# Altium schematic sheet kamal_schematic.SchDoc
size A1; SheetNumber: 1; SheetTotal: 1
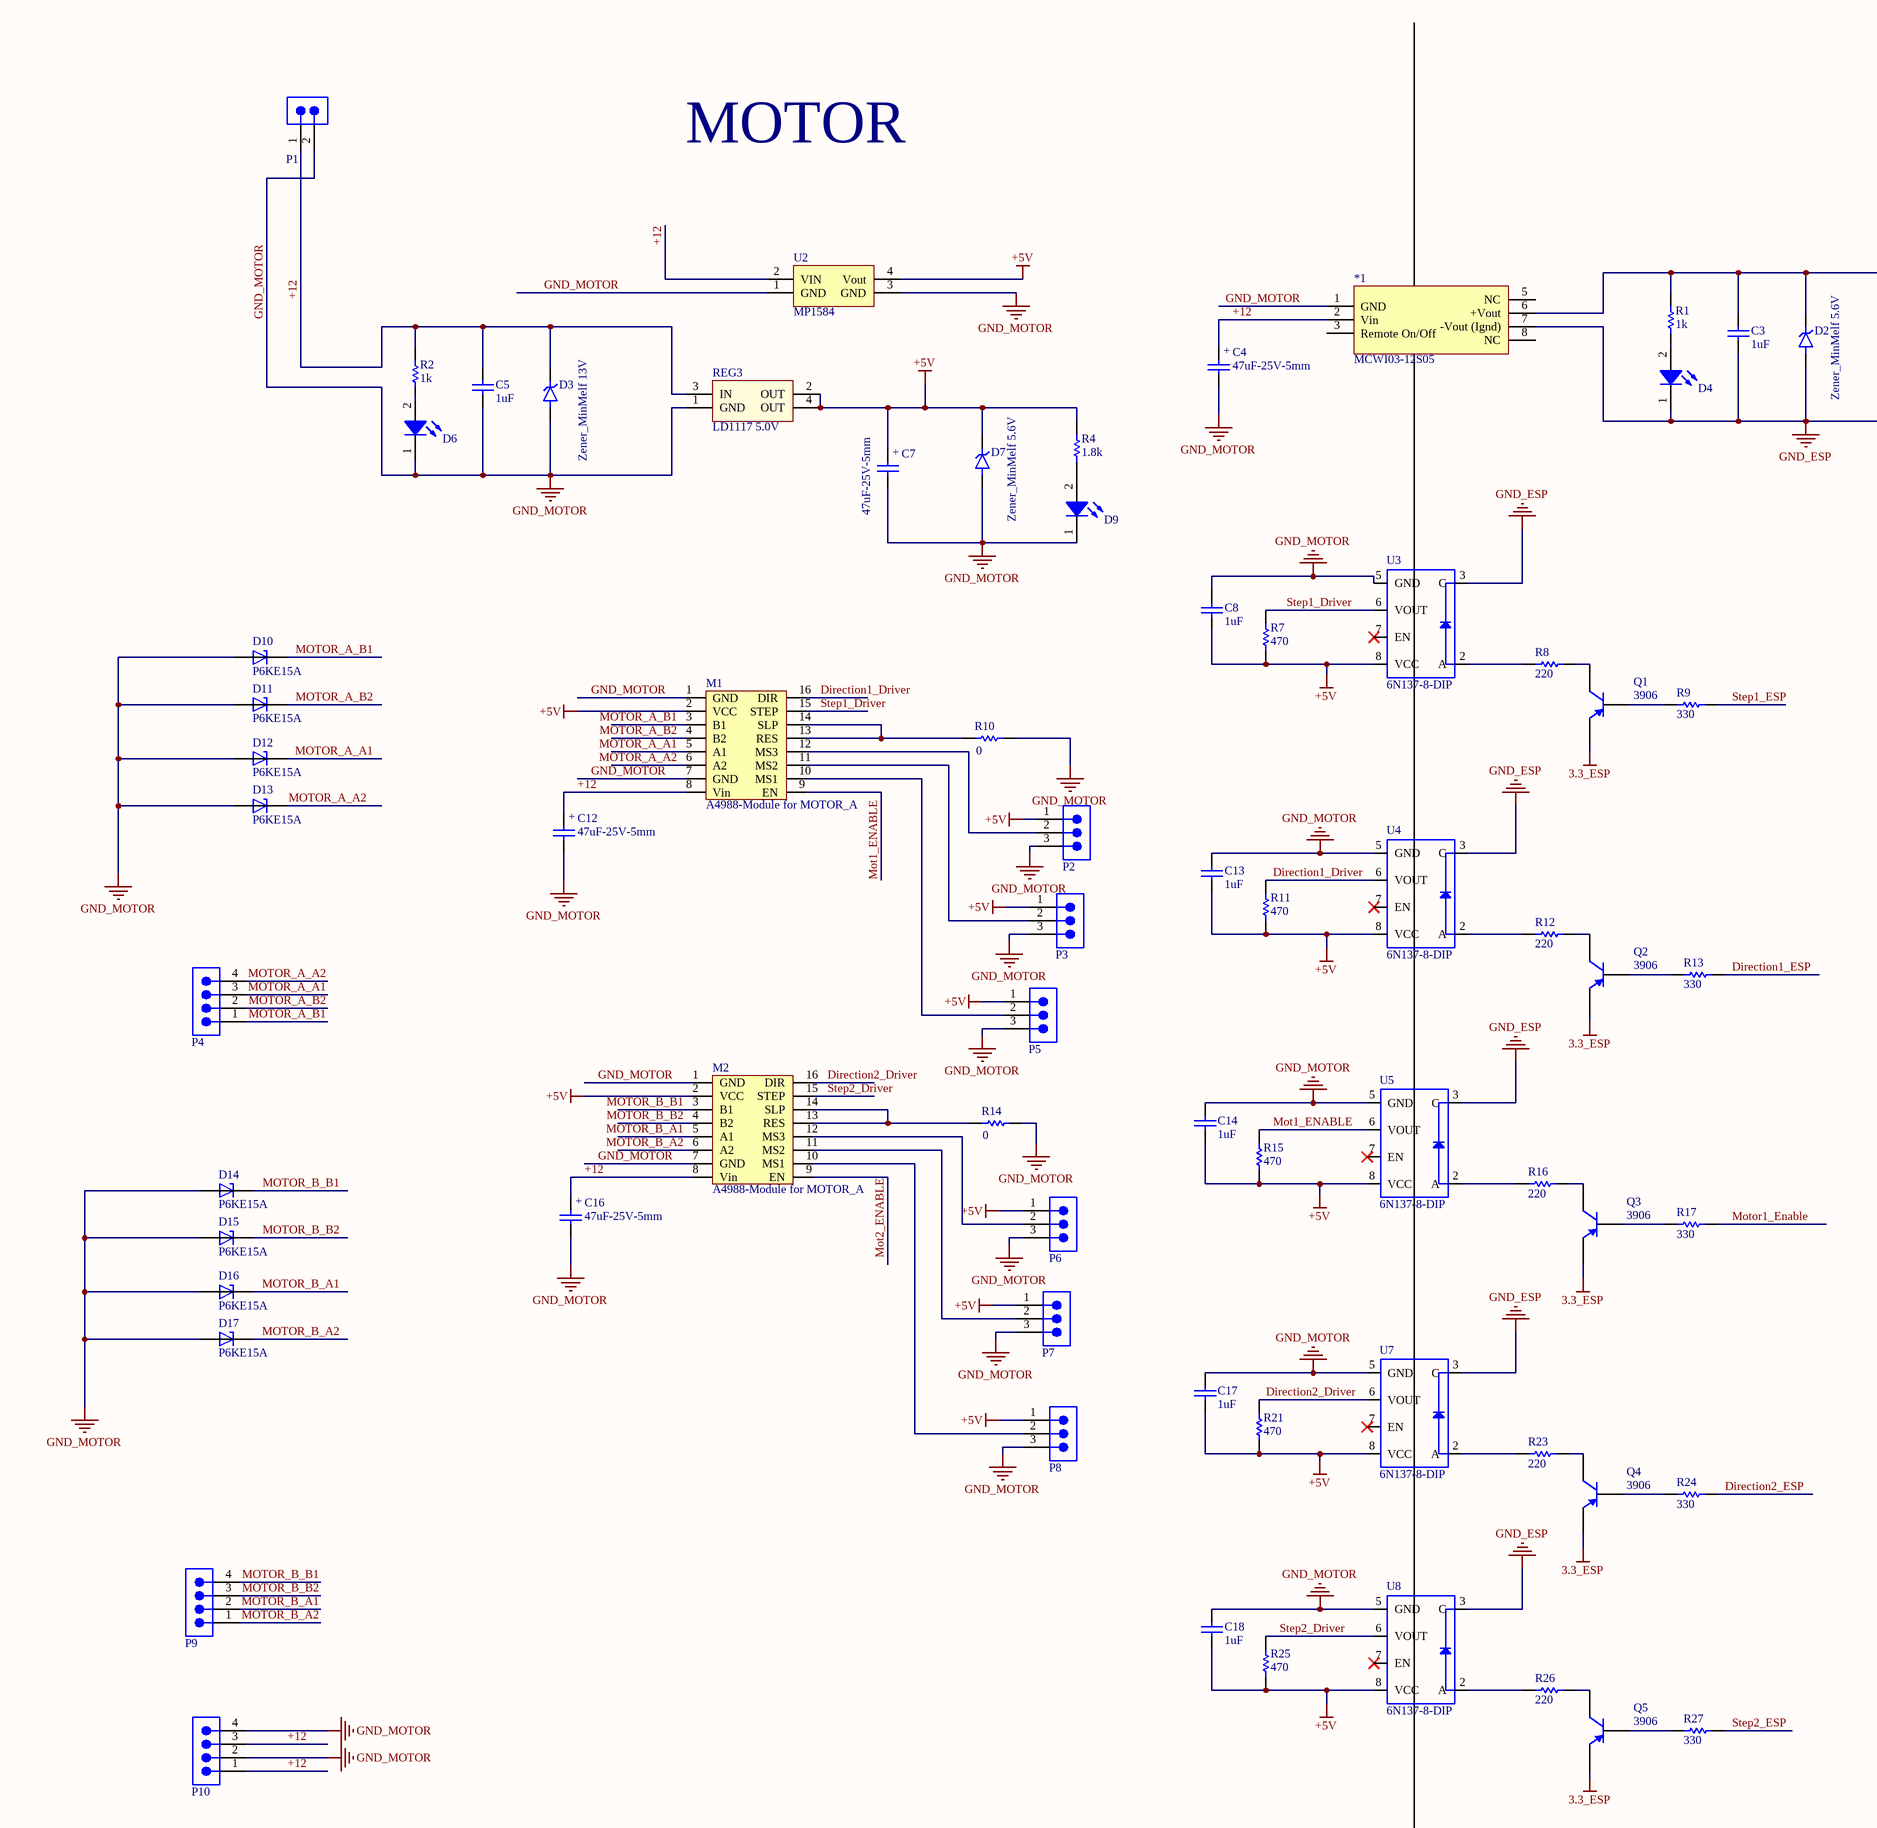
[diagram p0: kamal_schematic.SchDoc, top left]
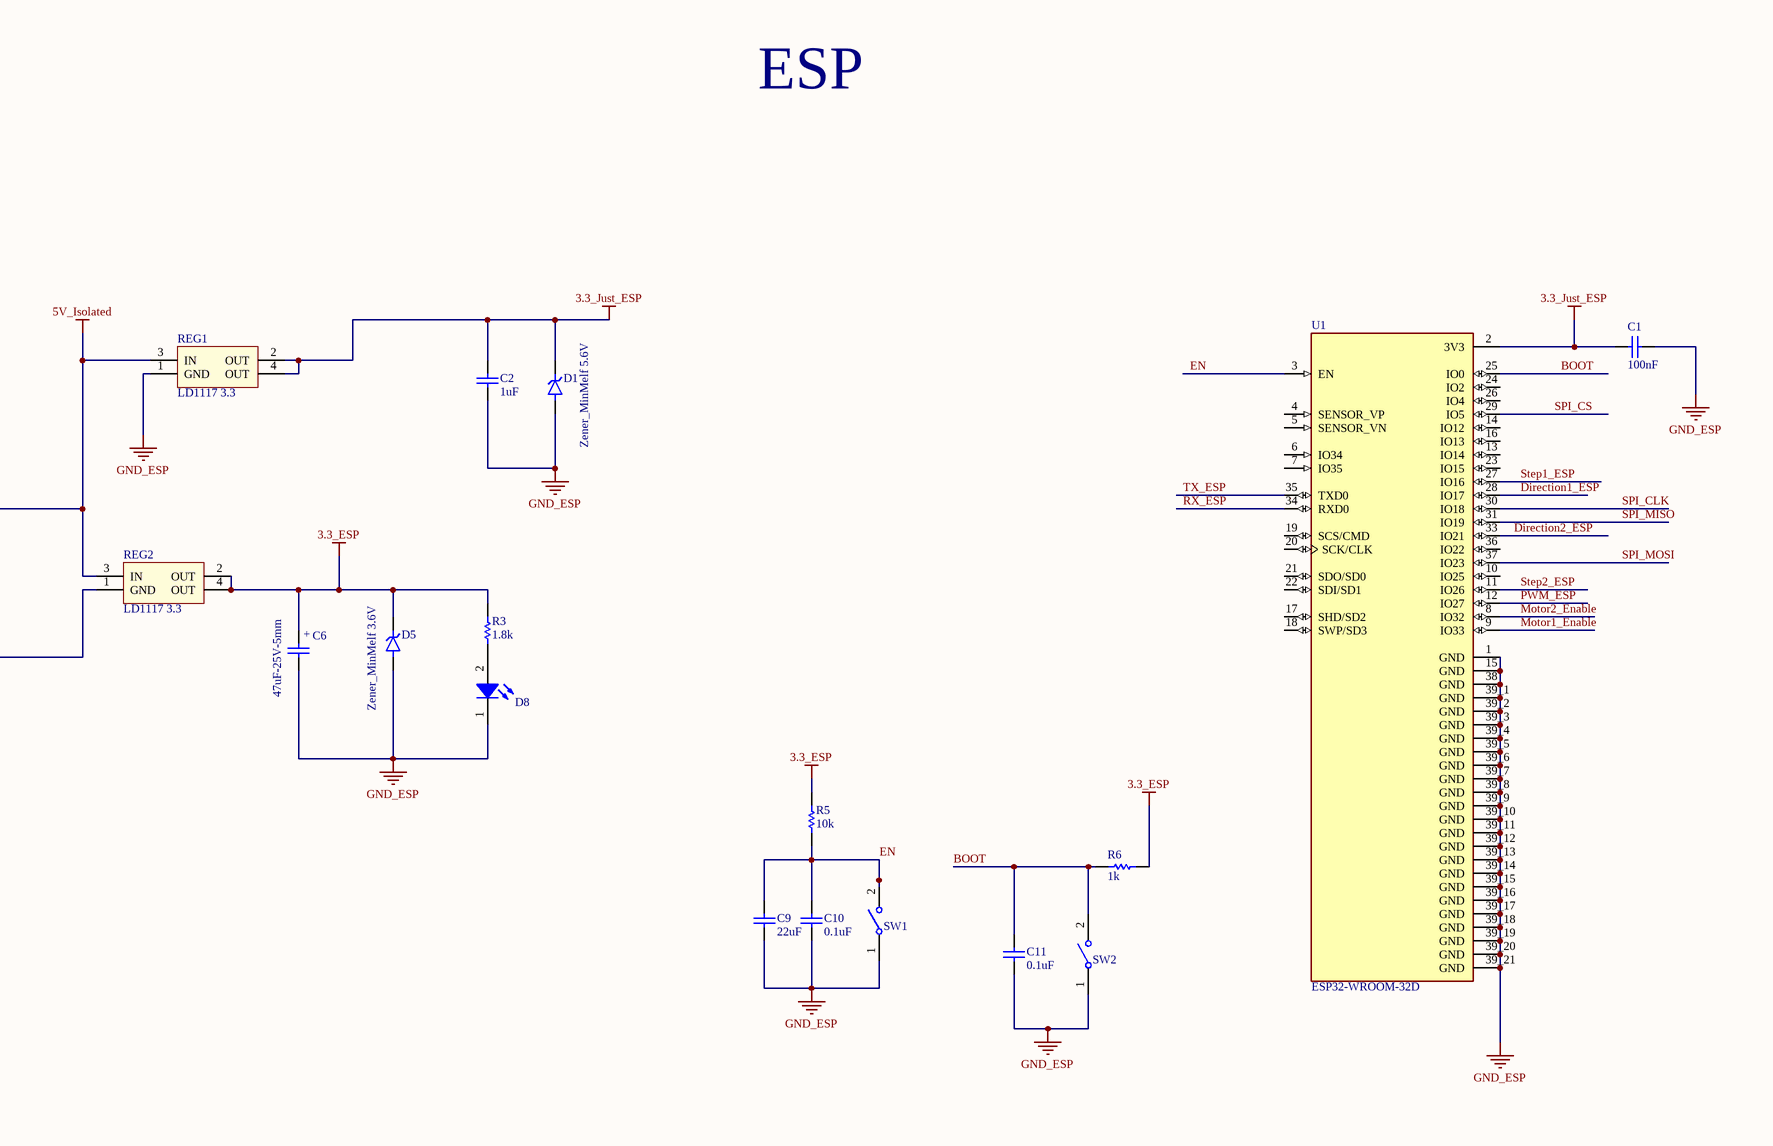
[diagram p1: kamal_schematic.SchDoc, top right]
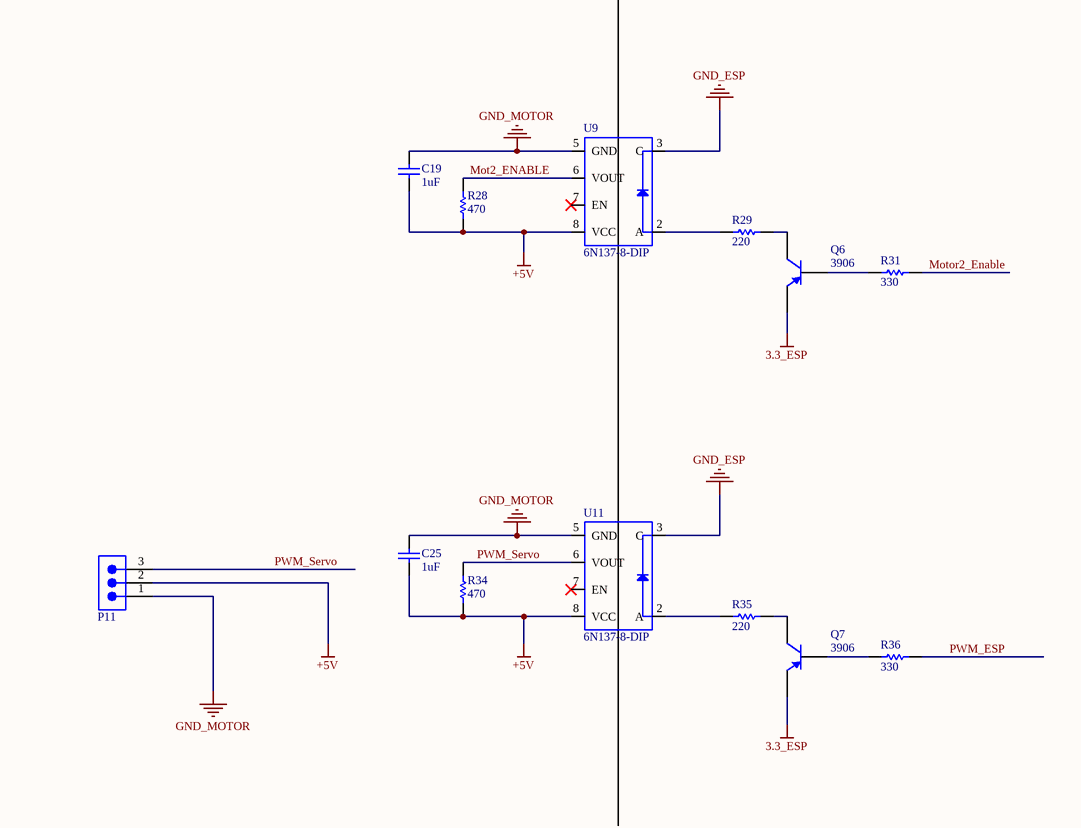
[diagram p2: kamal_schematic.SchDoc, bottom left]
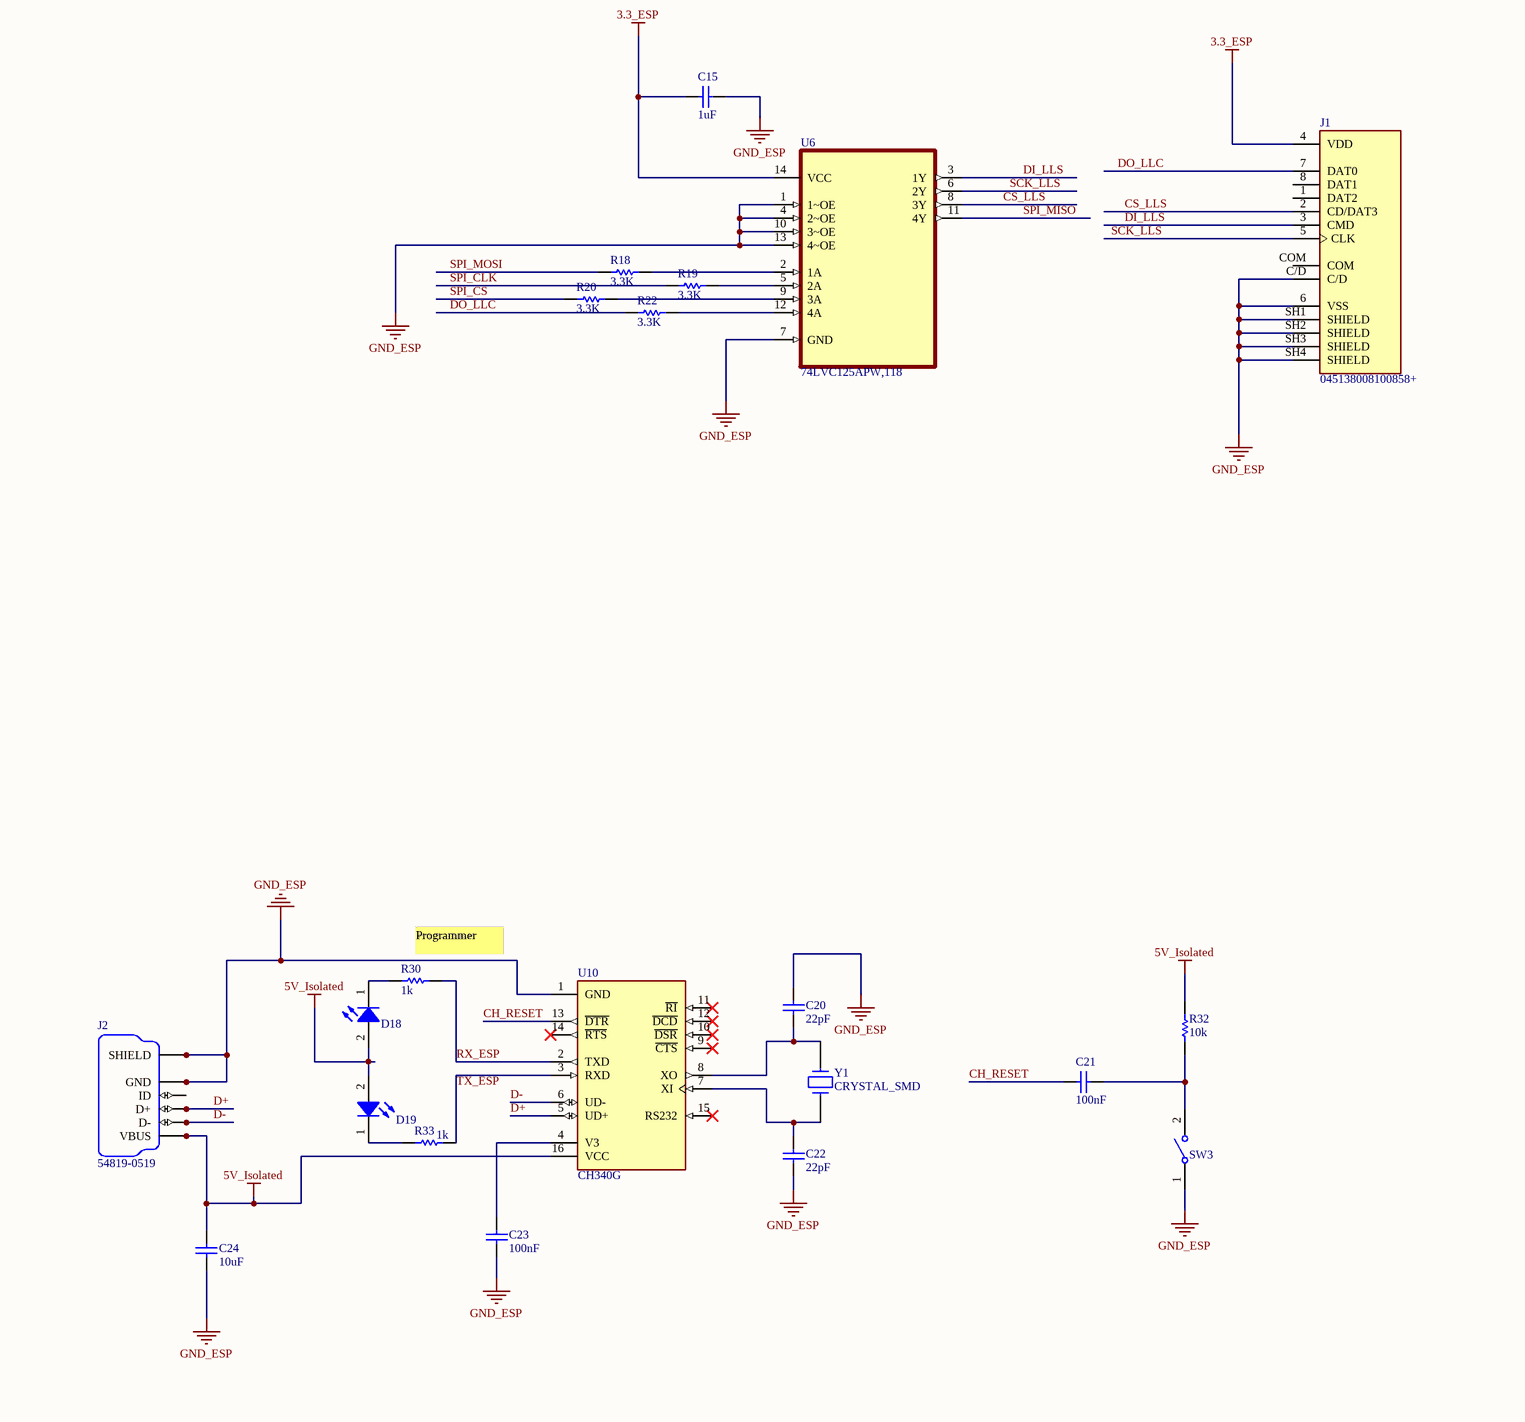
[diagram p3: kamal_schematic.SchDoc, bottom right]

## Parts
*1  MCWI03-12S05  [MCWI03-12S05]
C1  100nF  [SMD 805 CAP]
C2  1uF  [SMD 805 CAP]
C3  1uF  [SMD 805 CAP]
C4  47uF-25V-5mm  [MY_CAP_POL 5MM]
C5  1uF  [SMD 805 CAP]
C6  47uF-25V-5mm  [MY_CAP_POL 5MM]
C7  47uF-25V-5mm  [MY_CAP_POL 5MM]
C8  1uF  [SMD 805 CAP]
C9  22uF  [SMD 805 CAP]
C10  0.1uF  [SMD 805 CAP]
C11  0.1uF  [SMD 805 CAP]
C12  47uF-25V-5mm  [MY_CAP_POL 5MM]
C13  1uF  [SMD 805 CAP]
C14  1uF  [SMD 805 CAP]
C15  1uF  [SMD 805 CAP]
C16  47uF-25V-5mm  [MY_CAP_POL 5MM]
C17  1uF  [SMD 805 CAP]
C18  1uF  [SMD 805 CAP]
C19  1uF  [SMD 805 CAP]
C20  22pF  [C_805]
C21  100nF  [C_805]
C22  22pF  [C_805]
C23  100nF  [C_805]
C24  10uF  [Tantalum_B]
C25  1uF  [SMD 805 CAP]
D1  Zener_MinMelf 5.6V  [MiniMelf]
D2  Zener_MinMelf 5.6V  [MiniMelf]
D3  Zener_MinMelf 13V  [MiniMelf]
D4  LED_SMD_0805  [LED_0805]  (value not drawn)
D5  Zener_MinMelf 3.6V  [MiniMelf]
D6  LED_SMD_0805  [LED_0805]  (value not drawn)
D7  Zener_MinMelf 5.6V  [MiniMelf]
D8  LED_SMD_0805  [LED_0805]  (value not drawn)
D9  LED_SMD_0805  [LED_0805]  (value not drawn)
D10  P6KE15A  [P6KE15A]
D11  P6KE15A  [P6KE15A]
D12  P6KE15A  [P6KE15A]
D13  P6KE15A  [P6KE15A]
D14  P6KE15A  [P6KE15A]
D15  P6KE15A  [P6KE15A]
D16  P6KE15A  [P6KE15A]
D17  P6KE15A  [P6KE15A]
D18  LED_SMD_0805  [LED_0805]  (value not drawn)
D19  LED_SMD_0805  [LED_0805]  (value not drawn)
J1  045138008100858+  [AVX_045138008100858+]
J2  54819-0519  [MOLEX_54819-0519]
M1  A4988-Module for MOTOR_A  [A4988-Module - duplicate]
M2  A4988-Module for MOTOR_A  [A4988-Module - duplicate]
P1  691321300002  [691321300002]  (value not drawn)
P2  61300311121  [61300311121]  (value not drawn)
P3  61300311121  [61300311121]  (value not drawn)
P4  691321300004  [691321300004]  (value not drawn)
P5  61300311121  [61300311121]  (value not drawn)
P6  61300311121  [61300311121]  (value not drawn)
P7  61300311121  [61300311121]  (value not drawn)
P8  61300311121  [61300311121]  (value not drawn)
P9  691321300004  [691321300004]  (value not drawn)
P10  691321300004  [691321300004]  (value not drawn)
P11  691321300003  [691321300003]  (value not drawn)
Q1  3906  [MY_SMD_TRANSISTOR]
Q2  3906  [MY_SMD_TRANSISTOR]
Q3  3906  [MY_SMD_TRANSISTOR]
Q4  3906  [MY_SMD_TRANSISTOR]
Q5  3906  [MY_SMD_TRANSISTOR]
Q6  3906  [MY_SMD_TRANSISTOR]
Q7  3906  [MY_SMD_TRANSISTOR]
R1  1k  [SMD 805]
R2  1k  [SMD 805]
R3  1.8k  [SMD 805]
R4  1.8k  [SMD 805]
R5  10k  [SMD 805]
R6  1k  [SMD 805]
R7  470  [SMD 805]
R8  220  [SMD 805]
R9  330  [SMD 805]
R10  0  [SMD 805]
R11  470  [SMD 805]
R12  220  [SMD 805]
R13  330  [SMD 805]
R14  0  [SMD 805]
R15  470  [SMD 805]
R16  220  [SMD 805]
R17  330  [SMD 805]
R18  3.3K  [SMD 805]
R19  3.3K  [SMD 805]
R20  3.3K  [SMD 805]
R21  470  [SMD 805]
R22  3.3K  [SMD 805]
R23  220  [SMD 805]
R24  330  [SMD 805]
R25  470  [SMD 805]
R26  220  [SMD 805]
R27  330  [SMD 805]
R28  470  [SMD 805]
R29  220  [SMD 805]
R30  value 1k  [R_805]  (hidden comment: Resistor SMD 0603)
R31  330  [SMD 805]
R32  value 10k  [R_805]  (hidden comment: Resistor SMD 0603)
R33  value 1k  [R_805]  (hidden comment: Resistor SMD 0603)
R34  470  [SMD 805]
R35  220  [SMD 805]
R36  330  [SMD 805]
REG1  LD1117 3.3  [MY_LD1117-3.3]
REG2  LD1117 3.3  [MY_LD1117-3.3]
REG3  LD1117 5.0V  [MY_LD1117-3.3]
SW1  434121043836  [WS-TASV_L6W3.5H4.3_4341x10438x6]  (value not drawn)
SW2  434121043836  [WS-TASV_L6W3.5H4.3_4341x10438x6]  (value not drawn)
SW3  434121043836  [WS-TASV_L6W3.5H4.3_4341x10438x6]  (value not drawn)
U1  ESP32-WROOM-32D  [MODULE_ESP32-WROOM-32D]
U2  MP1584  [MP1584]
U3  6N137-8-DIP  [PDIP-8]
U4  6N137-8-DIP  [PDIP-8]
U5  6N137-8-DIP  [PDIP-8]
U6  74LVC125APW,118  [SOP65P640X110-14N]
U7  6N137-8-DIP  [PDIP-8]
U8  6N137-8-DIP  [PDIP-8]
U9  6N137-8-DIP  [PDIP-8]
U10  CH340G  [SOIC127P600X180-16N]
U11  6N137-8-DIP  [PDIP-8]
Y1  CRYSTAL_SMD  [My_Crystal - SMD]

## Nets
3.3_ESP: C6.+ C15.1 D5.2 J1.4(VDD) Q1.E Q2.E Q3.E Q4.E Q5.E Q6.E Q7.E R3.2 R5.2 R6.2 REG2.2(OUT) REG2.4(OUT) U6.14(VCC)
3.3_Just_ESP: C1.2 C2.2 D1.2 REG1.2(OUT) REG1.4(OUT) U1.2(3V3)
5V_Isolated: *1.6(+Vout) C3.2 C24.2 D2.2 D18.2(A) D19.2(A) J2.1(VBUS) J2.6(VBUS) R1.2 R32.1 REG1.3(IN) REG2.3(IN) U10.16(VCC)
+5V: C7.+ C8.2 C13.2 C14.2 C17.2 C18.2 C19.2 C25.2 D7.2 M1.2(VCC) M2.2(VCC) P2.1 P3.1 P5.1 P6.1 P7.1 P8.1 P11.2 R4.2 R7.2 R11.2 R15.2 R21.2 R25.2 R28.2 R34.2 REG3.2(OUT) REG3.4(OUT) U2.4(Vout) U3.8(VCC) U4.8(VCC) U5.8(VCC) U7.8(VCC) U8.8(VCC) U9.8(VCC) U11.8(VCC)
GND_ESP: *1.7(-Vout_(Ignd)) C1.1 C2.1 C3.1 C6.- C9.1 C10.1 C11.1 C15.2 C20.1 C22.2 C23.2 C24.1 D1.1 D2.1 D4.1(K) D5.1 D8.1(K) J1.6(VSS) J1.C/D J1.SH1(SHIELD) J1.SH2(SHIELD) J1.SH3(SHIELD) J1.SH4(SHIELD) J2.5(GND) J2.10(GND) J2.11(SHIELD) J2.12(SHIELD) J2.S1(SHIELD) J2.S2(SHIELD) REG1.1(GND) REG2.1(GND) SW1.1 SW2.1 SW3.1 U1.1(GND) U1.15(GND) U1.38(GND) U1.39_1(GND) U1.39_2(GND) U1.39_3(GND) U1.39_4(GND) U1.39_5(GND) U1.39_6(GND) U1.39_7(GND) U1.39_8(GND) U1.39_9(GND) U1.39_10(GND) U1.39_11(GND) U1.39_12(GND) U1.39_13(GND) U1.39_14(GND) U1.39_15(GND) U1.39_16(GND) U1.39_17(GND) U1.39_18(GND) U1.39_19(GND) U1.39_20(GND) U1.39_21(GND) U3.3(C) U4.3(C) U5.3(C) U6.1(1~OE) U6.4(2~OE) U6.7(GND) U6.10(3~OE) U6.13(4~OE) U7.3(C) U8.3(C) U9.3(C) U10.1(GND) U11.3(C)
GND_MOTOR: *1.1(GND) C4.- C5.1 C7.- C8.1 C12.- C13.1 C14.1 C16.- C17.1 C18.1 C19.1 C25.1 D3.1 D6.1(K) D7.1 D9.1(K) D10.A D11.A D12.A D13.A D14.A D15.A D16.A D17.A M1.1(GND) M1.7(GND) M2.1(GND) M2.7(GND) P1.2 P2.3 P3.3 P5.3 P6.3 P7.3 P8.3 P10.2 P10.4 P11.1 R10.1 R14.1 REG3.1(GND) U2.1(GND) U2.3(GND) U3.5(GND) U4.5(GND) U5.5(GND) U7.5(GND) U8.5(GND) U9.5(GND) U11.5(GND)
+12: *1.2(Vin) C4.+ C5.2 C12.+ C16.+ D3.2 M1.8(Vin) M2.8(Vin) P1.1 P10.1 P10.3 R2.2 REG3.3(IN) U2.2(VIN)
BOOT: C11.2 R6.1 SW2.2 U1.25(IO0)
CH_RESET: C21.2 U10.13(~{DTR})
CS_LLS: J1.2(CD/DAT3) U6.8(3Y)
D+: J2.3(D+) J2.8(D+) U10.5(UD+)
D-: J2.2(D-) J2.7(D-) U10.6(UD-)
DI_LLS: J1.3(CMD) U6.3(1Y)
Direction1_Driver: M1.16(DIR) R11.1 U4.6(VOUT)
Direction1_ESP: R13.2 U1.28(IO17)
Direction2_Driver: M2.16(DIR) R21.1 U7.6(VOUT)
Direction2_ESP: R24.2 U1.33(IO21)
DO_LLC: J1.7(DAT0) R22.1
EN: C9.2 C10.2 R5.1 SW1.2 U1.3(EN)
Mot1_ENABLE: M1.9(EN) R15.1 U5.6(VOUT)
Mot2_ENABLE: M2.9(EN) R28.1 U9.6(VOUT)
Motor1_Enable: R17.2 U1.9(IO33)
Motor2_Enable: R31.2 U1.8(IO32)
MOTOR_A_A1: D12.C M1.5(A1) P4.3
MOTOR_A_A2: D13.C M1.6(A2) P4.4
MOTOR_A_B1: D10.C M1.3(B1) P4.1
MOTOR_A_B2: D11.C M1.4(B2) P4.2
MOTOR_B_A1: D16.C M2.5(A1) P9.2
MOTOR_B_A2: D17.C M2.6(A2) P9.1
MOTOR_B_B1: D14.C M2.3(B1) P9.4
MOTOR_B_B2: D15.C M2.4(B2) P9.3
PWM_ESP: R36.2 U1.12(IO27)
PWM_Servo: P11.3 R34.1 U11.6(VOUT)
RX_ESP: R30.2 U1.34(RXD0) U10.2(TXD)
SCK_LLS: J1.5(CLK) U6.6(2Y)
SPI_CLK: R19.1 U1.30(IO18)
SPI_CS: R20.1 U1.29(IO5)
SPI_MISO: U1.31(IO19) U6.11(4Y)
SPI_MOSI: R18.1 U1.37(IO23)
Step1_Driver: M1.15(STEP) R7.1 U3.6(VOUT)
Step1_ESP: R9.2 U1.27(IO16)
Step2_Driver: M2.15(STEP) R25.1 U8.6(VOUT)
Step2_ESP: R27.2 U1.11(IO26)
TX_ESP: R33.2 U1.35(TXD0) U10.3(RXD)
NetC20_2: C20.2 U10.8(XO) Y1.2
NetC21_1: C21.1 R32.2 SW3.2
NetC22_1: C22.1 U10.7(XI) Y1.1
NetC23_1: C23.1 U10.4(V3)
NetD4_2: D4.2(A) R1.1
NetD6_2: D6.2(A) R2.1
NetD8_2: D8.2(A) R3.1
NetD9_2: D9.2(A) R4.1
NetD18_1: D18.1(K) R30.1
NetD19_1: D19.1(K) R33.1
NetJ2_4: J2.4(ID) J2.9(ID)
NetM1_10: M1.10(MS1) P5.2
NetM1_11: M1.11(MS2) P3.2
NetM1_12: M1.12(MS3) P2.2
NetM1_13: M1.13(RES) M1.14(SLP) R10.2
NetM2_10: M2.10(MS1) P8.2
NetM2_11: M2.11(MS2) P7.2
NetM2_12: M2.12(MS3) P6.2
NetM2_13: M2.13(RES) M2.14(SLP) R14.2
NetQ1_B: Q1.B R9.1
NetQ1_C: Q1.C R8.2
NetQ2_B: Q2.B R13.1
NetQ2_C: Q2.C R12.2
NetQ3_B: Q3.B R17.1
NetQ3_C: Q3.C R16.2
NetQ4_B: Q4.B R24.1
NetQ4_C: Q4.C R23.2
NetQ5_B: Q5.B R27.1
NetQ5_C: Q5.C R26.2
NetQ6_B: Q6.B R31.1
NetQ6_C: Q6.C R29.2
NetQ7_B: Q7.B R36.1
NetQ7_C: Q7.C R35.2
NetR8_1: R8.1 U3.2(A)
NetR12_1: R12.1 U4.2(A)
NetR16_1: R16.1 U5.2(A)
NetR18_2: R18.2 U6.2(1A)
NetR19_2: R19.2 U6.5(2A)
NetR20_2: R20.2 U6.9(3A)
NetR22_2: R22.2 U6.12(4A)
NetR23_1: R23.1 U7.2(A)
NetR26_1: R26.1 U8.2(A)
NetR29_1: R29.1 U9.2(A)
NetR35_1: R35.1 U11.2(A)

Not connected (* = marked no-connect by the designer): *1 3(Remote_On/Off) 5(NC) 8(NC); J1 1(DAT2) 8(DAT1) COM; U1 4(SENSOR_VP) 5(SENSOR_VN) 6(IO34) 7(IO35) 10(IO25) 13(IO14) 14(IO12) 16(IO13) 17(SHD/SD2) 18(SWP/SD3) 19(SCS/CMD) 20(SCK/CLK) 21(SDO/SD0) 22(SDI/SD1) 23(IO15) 24(IO2) 26(IO4) 36(IO22); U3 7(EN)*; U4 7(EN)*; U5 7(EN)*; U7 7(EN)*; U8 7(EN)*; U9 7(EN)*; U10 9(~{CTS})* 10(~{DSR})* 11(~{RI})* 12(~{DCD})* 14(~{RTS})* 15(RS232)*; U11 7(EN)*

## Notes on the sheet
- ESP
- MOTOR
- (near R30) Programmer

## Library data of the parts
C1-C3 C5 C8-C11 C13-C15 C17-C19 C25 = CAP B
C4 C6 C7 C12 C16 = Cap Pol_5mm: CAP-3300Uf; Value: 3300u
C20-C24 = CAP SMD 0805: CAP 0805; Designer: Abbas Basereh; Desc.: CAP SMD 0805; Data: 16-12-2016
D1-D3 D5 D7 = MiniMelf_500mW: MP: ZM4736A_L0; Package: None; Availability: Unavailable; Price: None; Value: *
J1 = 045138008100858+: Ked04 5138 008100858+ Micro Sd; MF: AVX / Kyocera; SnapEDA_Link: https://www.snapeda.com/parts/04%205138%20008100858%2B/AVX%20/%20Kyocera/view-part/562780/?ref=snap; Availability: Unavailable; MP: 04 5138 008100858+; Value: *; Price: None; Package: None
J2 = 54819-0519: USB - mini B USB 2.0 OTG Receptacle Connector 5 Position Through Hole, Right Angle; MF: Molex; Availability: Good; MP: 54819-0519; Purchase-URL: https://pricing.snapeda.com/search/part/54819-0519/?ref=eda; Value: *; Check_prices: https://www.snapeda.com/parts/54819-0519/Molex/view-part/13744/?ref=eda; SnapEDA_Link: https://www.snapeda.com/parts/54819-0519/Molex/view-part/13744/?ref=snap; Price: None; Package: None
M1 M2 = A4988SETTR-T: ALLEGRO MICROSYSTEMS - A4988SETTR-T - MOTOR DRIVER, STEPPER, 2A, QFN-28; Min Supply Voltage: 8V; Max Supply Voltage: 35V; Number of Outputs: 1; Supplier 1: Digi-Key; Manufacturer: Allegro MicroSystems; Manufacturer Part Number: A4988SETTR-T; Stock 1: 16515; Pricing 1: 1=3.27, 10=2.934, 100=2.4042, 500=2.0466 (USD); Mount: Surface Mount; Case/Package: QFN EP; Number of Pins: 28; Min Operating Temperature: -20°C; Max Operating Temperature: 85°C; Package Quantity: 1; Output Current: 2A; Packaging: Tape and Reel; Output Voltage: 35V; Motor Type: Stepper; Radiation Hardening: No; REACH SVHC: No SVHC; ComponentLink1URL: http://www.farnell.com/datasheets/2354165.pdf?src-supplier=Newark; ComponentLink1Description: http://www.farnell.com/datasheets/2354165.pdf?src-supplier=Newark; ComponentLink2URL: http://www.farnell.com/datasheets/2354165.pdf?src-supplier=Element14; ComponentLink2Description: http://www.farnell.com/datasheets/2354165.pdf?src-supplier=Element14; ComponentLink3URL: https://www.verical.com/server-webapp/html/getDatasheet?partID=557828&src-supplier=Verical; ComponentLink3Description: https://www.verical.com/server-webapp/html/getDatasheet?partID=557828&src-supplier=Verical; ComponentLink4URL: http://www.allegromicro.com/en/Products/Motor-Driver-And-Interface-ICs/Bipolar-Stepper-Motor-Drivers/~/media/Files/Datasheets/A4988-Datasheet.ashx?src-supplier=Avnet+Europe; ComponentLink4Description: http://www.allegromicro.com/en/Products/Motor-Driver-And-Interface-ICs/Bipolar-Stepper-Motor-Drivers/~/media/Files/Datasheets/A4988-Datasheet.ashx?src-supplier=Avnet+Europe; ComponentLink5URL: http://www.allegromicro.com/en/Products/Motor-Driver-And-Interface-ICs/Bipolar-Stepper-Motor-Drivers/~/media/Files/Datasheets/A4988-Datasheet.ashx?src-supplier=Avnet; ComponentLink5Description: http://www.allegromicro.com/en/Products/Motor-Driver-And-Interface-ICs/Bipolar-Stepper-Motor-Drivers/~/media/Files/Datasheets/A4988-Datasheet.ashx?src-supplier=Avnet; Supplier Part Number 1: 620-1343-6-ND; Category: Moudle
P1 = 691321300002: WR-TBL Series 321 Vertical PCB Header, THT, pitch 3.81mm, 2p; Manufacturer: Wurth Elektronik; Modularity: No; Rated Current: 10A; Working Voltage: 300V; ComponentLink1Description: Website Link; ComponentLink1URL: https://www.we-online.com/redexpert/article/691321300002?ad; ComponentLink2Description: Datasheet Link; ComponentLink2URL: https://www.we-online.com/redexpert/spec/691321300002?ad; Manufacturer Part Number: 691321300002; Category: Terminal Blocks; Match Code: WR-TBL; Mount: Through Hole; Operating Temperature Max: 105°C; Operating Temperature Min: -40°C; Packaging: Box; Application: Pluggable; Number of Pins: 2; Number of Rows: 1; Orientation: Vertical; Pitch: 3.81mm
P2 P3 P5-P8 = 61300311121: WR-PHD Pin Header, THT, Vertical, pitch 2.54mm, 1 Row, 3P; Manufacturer: Wurth Elektronik; Contact Resistance: 20mΩ; Rated Current: 3A; Working Voltage: 250V; Withstanding Voltage: 500V; ComponentLink1Description: Website Link; ComponentLink1URL: https://www.we-online.com/redexpert/article/61300311121?ad; ComponentLink2Description: Datasheet Link; ComponentLink2URL: https://www.we-online.com/redexpert/spec/61300311121?ad; Manufacturer Part Number: 61300311121; Category: Board-to-Board Connectors; Match Code: WR-PHD; Mount: Through Hole; Operating Temperature Max: 105°C; Operating Temperature Min: -40°C; Packaging: Bag; Gender: Pin Header; Number of Pins: 3; Number of Rows: 1; Orientation: Vertical; Pitch: 2.54mm
P4 P9 P10 = 691321300004: WR-TBL Series 321 Vertical PCB Header, THT, pitch 3.81mm, 4p; Manufacturer: Wurth Elektronik; Modularity: No; Rated Current: 10A; Working Voltage: 300V; ComponentLink1Description: Website Link; ComponentLink1URL: https://www.we-online.com/redexpert/article/691321300004?ad; ComponentLink2Description: Datasheet Link; ComponentLink2URL: https://www.we-online.com/redexpert/spec/691321300004?ad; Manufacturer Part Number: 691321300004; Category: Terminal Blocks; Match Code: WR-TBL; Mount: Through Hole; Operating Temperature Max: 105°C; Operating Temperature Min: -40°C; Packaging: Box; Application: Pluggable; Number of Pins: 4; Number of Rows: 1; Orientation: Vertical; Pitch: 3.81mm
P11 = 691321300003: WR-TBL Series 321 Vertical PCB Header, THT, pitch 3.81mm, 3p; Manufacturer: Wurth Elektronik; Modularity: No; Rated Current: 10A; Working Voltage: 300V; ComponentLink1Description: Website Link; ComponentLink1URL: https://www.we-online.com/redexpert/article/691321300003?ad; ComponentLink2Description: Datasheet Link; ComponentLink2URL: https://www.we-online.com/redexpert/spec/691321300003?ad; Manufacturer Part Number: 691321300003; Category: Terminal Blocks; Match Code: WR-TBL; Mount: Through Hole; Operating Temperature Max: 105°C; Operating Temperature Min: -40°C; Packaging: Box; Application: Pluggable; Number of Pins: 3; Number of Rows: 1; Orientation: Vertical; Pitch: 3.81mm
Q1-Q7 = 3906 SMD TRANSISTOR: PNP 60V 625mW IC=200mA
R1-R29 R31 R34-R36 = Resistor
REG3 = LD1117 3.3
SW1-SW3 = 434121043836: WS-TASV SMT Tact Switch, SPST-NO, 12VDC, 50mA, 360g; Manufacturer: Wurth Elektronik; Washable: No; ComponentLink1Description: Website Link; ComponentLink1URL: https://www.we-online.com/redexpert/article/434121043836?ad; ComponentLink2Description: Datasheet Link; ComponentLink2URL: https://www.we-online.com/redexpert/spec/434121043836?ad; Manufacturer Part Number: 434121043836; Category: Tact Switches; Match Code: WS-TASV; Mount: Surface Mount; Operating Temperature Max: 85°C; Operating Temperature Min: -40°C; Packaging: Tape and Reel; Length: 6mm; Width: 3.5mm; Height: 4.3mm; Circuit: SPST-NO; Contact Material: Stainless Steel; Contact Plating: Silver; Operation Force: 360g; Rated Current: 50mA; Rated Voltage: 12VDC; Terminal Material: Copper Alloy; Terminal Plating: Silver
U1 = ESP32-WROOM-32D: Bluetooth, WiFi 802.11b/g/n, Bluetooth v4.2 + EDR, Class 1, 2 and 3 Transceiver Module 2.4GHz ~ 2.5GHz Integrated, Trace Surface Mount; Value: *; Availability: Unavailable; Price: None; Package: None; MP: ESP32-WROOM-32D
U6 = 74LVC125APW,118: Buffer, Non-Inverting 4 Element 1 Bit per Element 3-State Output 14-TSSOP; MF: Nexperia USA Inc.; SnapEDA_Link: https://www.snapeda.com/parts/74LVC125APW,118/Nexperia/view-part/5248541/?ref=snap; Package: TSSOP14-14 Nexperia USA Inc.; Check_prices: https://www.snapeda.com/parts/74LVC125APW,118/Nexperia/view-part/5248541/?ref=eda; MP: 74LVC125APW,118; Value: *; Availability: In Stock; Price: None
Y1 = CRYSTAL_SMD: Crystal
R30 R32 R33 = Resistor SMD 0603: DatasheetVersion: 2021; ComponentLink1Description: Website: Tarahiboard; ComponentLink1URL: https://www.tarahiboard.com/; ComponentLink2Description: Telegram; ComponentLink2URL: https://t.me/tarahiboard; ComponentLink3Description: Instagram; ComponentLink3URL: https://instagram.com/tarahiboard
U10 = CH340G: Value: *; MP: CH340G; Package: None; Availability: Unavailable; Price: None